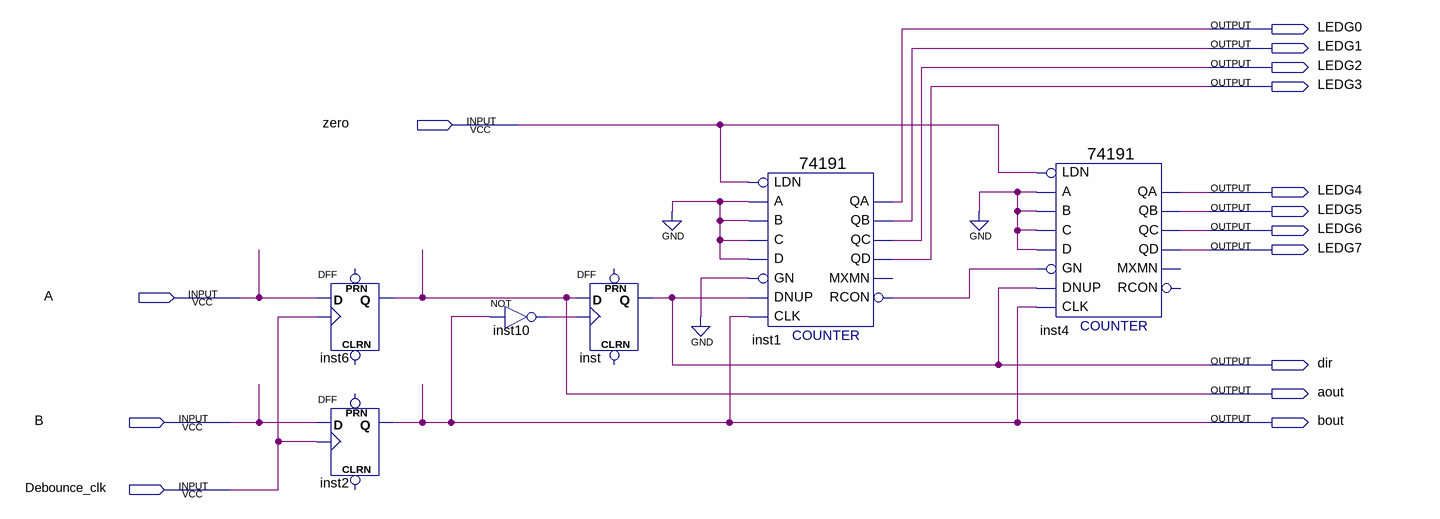
[diagram p0: schematic sheet]
// Quartus schematic Simple.bdf as structural Verilog: 6 symbols, 15 pins
module Simple (
  input  zero,
  input  A,
  input  B,
  input  Debounce_clk,
  output LEDG0,
  output LEDG1,
  output LEDG2,
  output LEDG3,
  output LEDG4,
  output LEDG5,
  output LEDG6,
  output LEDG7,
  output dir,
  output aout,
  output bout
);

  wire inst1_rcon, inst10_out;

  DFF inst6 (.CLK(Debounce_clk), .D(A), .Q(aout));  // open: CLRN, PRN
  DFF inst2 (.CLK(Debounce_clk), .D(B), .Q(bout));  // open: CLRN, PRN
  not inst10 (inst10_out, bout);
  DFF inst (.CLK(inst10_out), .D(aout), .Q(dir));  // open: CLRN, PRN
  \74191  inst1 (
    .LDN(zero), .D(1'b0), .C(1'b0), .B(1'b0), .A(1'b0), .CLK(bout), .DNUP(dir), .GN(1'b0), .RCON(inst1_rcon),
    .QA(LEDG0), .QB(LEDG1), .QD(LEDG3), .QC(LEDG2));  // open: MXMN
  \74191  inst4 (
    .LDN(zero), .D(1'b0), .C(1'b0), .B(1'b0), .A(1'b0), .CLK(bout), .DNUP(dir), .GN(inst1_rcon), .QA(LEDG4),
    .QB(LEDG5), .QD(LEDG7), .QC(LEDG6));  // open: RCON, MXMN
endmodule
